# Altium project LED PD AB WH 3000149 (4F00227L_7P00500A).PrjPcb
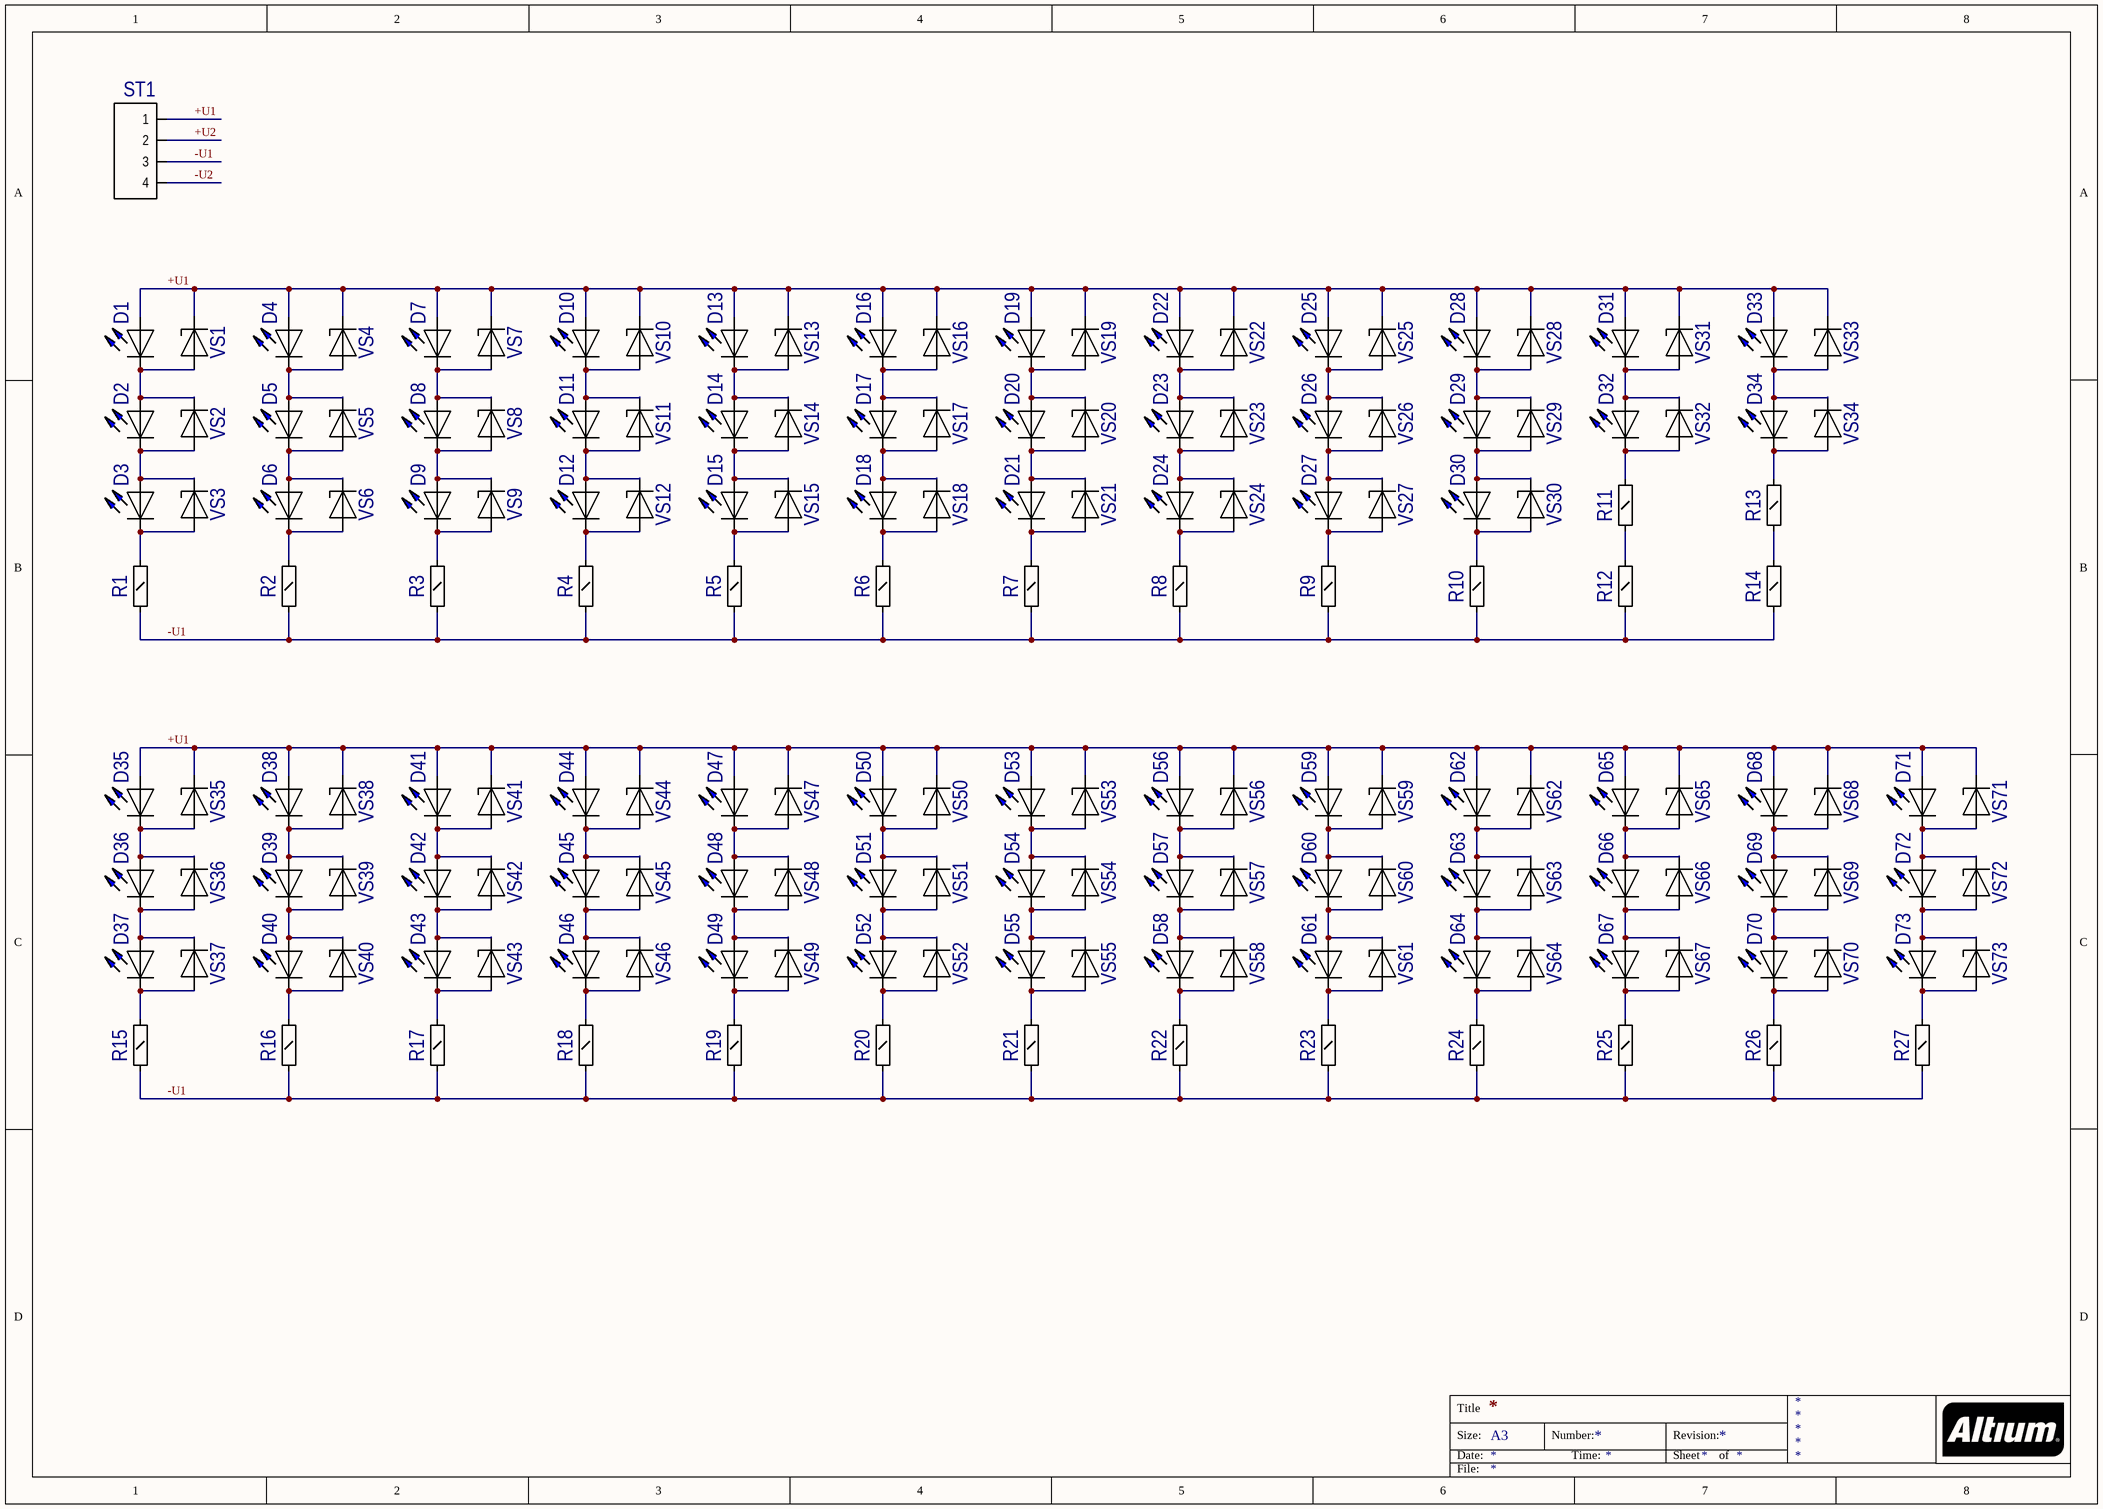
[diagram p0: LED PD AB WH 3000149 (4F00227L_7P00500A)_1.SchDoc]
2 sheets, 327 parts. Net scope: global (net labels, ports and power ports of the same name join across sheets).
Board file: LED PD AB WH 3000149 (4F00227L_7P00500A).PcbDoc
Sheets:
  LED PD AB WH 3000149 (4F00227L_7P00500A)_1.SchDoc
  LED PD AB WH 3000149 (4F00227L_7P00500A)_2.SchDoc

## Sheet LED PD AB WH 3000149 (4F00227L_7P00500A)_1.SchDoc
size A3

### Parts
D1  LT_T66G  [T66G]  (value not drawn)
D2  LT_T66G  [T66G]  (value not drawn)
D3  LT_T66G  [T66G]  (value not drawn)
D4  LT_T66G  [T66G]  (value not drawn)
D5  LT_T66G  [T66G]  (value not drawn)
D6  LT_T66G  [T66G]  (value not drawn)
D7  LT_T66G  [T66G]  (value not drawn)
D8  LT_T66G  [T66G]  (value not drawn)
D9  LT_T66G  [T66G]  (value not drawn)
D10  LT_T66G  [T66G]  (value not drawn)
D11  LT_T66G  [T66G]  (value not drawn)
D12  LT_T66G  [T66G]  (value not drawn)
D13  LT_T66G  [T66G]  (value not drawn)
D14  LT_T66G  [T66G]  (value not drawn)
D15  LT_T66G  [T66G]  (value not drawn)
D16  LT_T66G  [T66G]  (value not drawn)
D17  LT_T66G  [T66G]  (value not drawn)
D18  LT_T66G  [T66G]  (value not drawn)
D19  LT_T66G  [T66G]  (value not drawn)
D20  LT_T66G  [T66G]  (value not drawn)
D21  LT_T66G  [T66G]  (value not drawn)
D22  LT_T66G  [T66G]  (value not drawn)
D23  LT_T66G  [T66G]  (value not drawn)
D24  LT_T66G  [T66G]  (value not drawn)
D25  LT_T66G  [T66G]  (value not drawn)
D26  LT_T66G  [T66G]  (value not drawn)
D27  LT_T66G  [T66G]  (value not drawn)
D28  LT_T66G  [T66G]  (value not drawn)
D29  LT_T66G  [T66G]  (value not drawn)
D30  LT_T66G  [T66G]  (value not drawn)
D31  LT_T66G  [T66G]  (value not drawn)
D32  LT_T66G  [T66G]  (value not drawn)
D33  LT_T66G  [T66G]  (value not drawn)
D34  LT_T66G  [T66G]  (value not drawn)
D35  LT_T66G  [T66G]  (value not drawn)
D36  LT_T66G  [T66G]  (value not drawn)
D37  LT_T66G  [T66G]  (value not drawn)
D38  LT_T66G  [T66G]  (value not drawn)
D39  LT_T66G  [T66G]  (value not drawn)
D40  LT_T66G  [T66G]  (value not drawn)
D41  LT_T66G  [T66G]  (value not drawn)
D42  LT_T66G  [T66G]  (value not drawn)
D43  LT_T66G  [T66G]  (value not drawn)
D44  LT_T66G  [T66G]  (value not drawn)
D45  LT_T66G  [T66G]  (value not drawn)
D46  LT_T66G  [T66G]  (value not drawn)
D47  LT_T66G  [T66G]  (value not drawn)
D48  LT_T66G  [T66G]  (value not drawn)
D49  LT_T66G  [T66G]  (value not drawn)
D50  LT_T66G  [T66G]  (value not drawn)
D51  LT_T66G  [T66G]  (value not drawn)
D52  LT_T66G  [T66G]  (value not drawn)
D53  LT_T66G  [T66G]  (value not drawn)
D54  LT_T66G  [T66G]  (value not drawn)
D55  LT_T66G  [T66G]  (value not drawn)
D56  LT_T66G  [T66G]  (value not drawn)
D57  LT_T66G  [T66G]  (value not drawn)
D58  LT_T66G  [T66G]  (value not drawn)
D59  LT_T66G  [T66G]  (value not drawn)
D60  LT_T66G  [T66G]  (value not drawn)
D61  LT_T66G  [T66G]  (value not drawn)
D62  LT_T66G  [T66G]  (value not drawn)
D63  LT_T66G  [T66G]  (value not drawn)
D64  LT_T66G  [T66G]  (value not drawn)
D65  LT_T66G  [T66G]  (value not drawn)
D66  LT_T66G  [T66G]  (value not drawn)
D67  LT_T66G  [T66G]  (value not drawn)
D68  LT_T66G  [T66G]  (value not drawn)
D69  LT_T66G  [T66G]  (value not drawn)
D70  LT_T66G  [T66G]  (value not drawn)
D71  LT_T66G  [T66G]  (value not drawn)
D72  LT_T66G  [T66G]  (value not drawn)
D73  LT_T66G  [T66G]  (value not drawn)
R1  R1206S  [RC1206S]  (value not drawn)
R2  R1206S  [RC1206S]  (value not drawn)
R3  R1206S  [RC1206S]  (value not drawn)
R4  R1206S  [RC1206S]  (value not drawn)
R5  R1206S  [RC1206S]  (value not drawn)
R6  R1206S  [RC1206S]  (value not drawn)
R7  R1206S  [RC1206S]  (value not drawn)
R8  R1206S  [RC1206S]  (value not drawn)
R9  R1206S  [RC1206S]  (value not drawn)
R10  R1206S  [RC1206S]  (value not drawn)
R11  R1206S  [RC1206S]  (value not drawn)
R12  R1206S  [RC1206S]  (value not drawn)
R13  R1206S  [RC1206S]  (value not drawn)
R14  R1206S  [RC1206S]  (value not drawn)
R15  R1206S  [RC1206S]  (value not drawn)
R16  R1206S  [RC1206S]  (value not drawn)
R17  R1206S  [RC1206S]  (value not drawn)
R18  R1206S  [RC1206S]  (value not drawn)
R19  R1206S  [RC1206S]  (value not drawn)
R20  R1206S  [RC1206S]  (value not drawn)
R21  R1206S  [RC1206S]  (value not drawn)
R22  R1206S  [RC1206S]  (value not drawn)
R23  R1206S  [RC1206S]  (value not drawn)
R24  R1206S  [RC1206S]  (value not drawn)
R25  R1206S  [RC1206S]  (value not drawn)
R26  R1206S  [RC1206S]  (value not drawn)
R27  R1206S  [RC1206S]  (value not drawn)
ST1  BAND4  [BAND4]  (value not drawn)
VS1  BZX84  [SOT23]  (value not drawn)
VS2  BZX84  [SOT23]  (value not drawn)
VS3  BZX84  [SOT23]  (value not drawn)
VS4  BZX84  [SOT23]  (value not drawn)
VS5  BZX84  [SOT23]  (value not drawn)
VS6  BZX84  [SOT23]  (value not drawn)
VS7  BZX84  [SOT23]  (value not drawn)
VS8  BZX84  [SOT23]  (value not drawn)
VS9  BZX84  [SOT23]  (value not drawn)
VS10  BZX84  [SOT23]  (value not drawn)
VS11  BZX84  [SOT23]  (value not drawn)
VS12  BZX84  [SOT23]  (value not drawn)
VS13  BZX84  [SOT23]  (value not drawn)
VS14  BZX84  [SOT23]  (value not drawn)
VS15  BZX84  [SOT23]  (value not drawn)
VS16  BZX84  [SOT23]  (value not drawn)
VS17  BZX84  [SOT23]  (value not drawn)
VS18  BZX84  [SOT23]  (value not drawn)
VS19  BZX84  [SOT23]  (value not drawn)
VS20  BZX84  [SOT23]  (value not drawn)
VS21  BZX84  [SOT23]  (value not drawn)
VS22  BZX84  [SOT23]  (value not drawn)
VS23  BZX84  [SOT23]  (value not drawn)
VS24  BZX84  [SOT23]  (value not drawn)
VS25  BZX84  [SOT23]  (value not drawn)
VS26  BZX84  [SOT23]  (value not drawn)
VS27  BZX84  [SOT23]  (value not drawn)
VS28  BZX84  [SOT23]  (value not drawn)
VS29  BZX84  [SOT23]  (value not drawn)
VS30  BZX84  [SOT23]  (value not drawn)
VS31  BZX84  [SOT23]  (value not drawn)
VS32  BZX84  [SOT23]  (value not drawn)
VS33  BZX84  [SOT23]  (value not drawn)
VS34  BZX84  [SOT23]  (value not drawn)
VS35  BZX84  [SOT23]  (value not drawn)
VS36  BZX84  [SOT23]  (value not drawn)
VS37  BZX84  [SOT23]  (value not drawn)
VS38  BZX84  [SOT23]  (value not drawn)
VS39  BZX84  [SOT23]  (value not drawn)
VS40  BZX84  [SOT23]  (value not drawn)
VS41  BZX84  [SOT23]  (value not drawn)
VS42  BZX84  [SOT23]  (value not drawn)
VS43  BZX84  [SOT23]  (value not drawn)
VS44  BZX84  [SOT23]  (value not drawn)
VS45  BZX84  [SOT23]  (value not drawn)
VS46  BZX84  [SOT23]  (value not drawn)
VS47  BZX84  [SOT23]  (value not drawn)
VS48  BZX84  [SOT23]  (value not drawn)
VS49  BZX84  [SOT23]  (value not drawn)
VS50  BZX84  [SOT23]  (value not drawn)
VS51  BZX84  [SOT23]  (value not drawn)
VS52  BZX84  [SOT23]  (value not drawn)
VS53  BZX84  [SOT23]  (value not drawn)
VS54  BZX84  [SOT23]  (value not drawn)
VS55  BZX84  [SOT23]  (value not drawn)
VS56  BZX84  [SOT23]  (value not drawn)
VS57  BZX84  [SOT23]  (value not drawn)
VS58  BZX84  [SOT23]  (value not drawn)
VS59  BZX84  [SOT23]  (value not drawn)
VS60  BZX84  [SOT23]  (value not drawn)
VS61  BZX84  [SOT23]  (value not drawn)
VS62  BZX84  [SOT23]  (value not drawn)
VS63  BZX84  [SOT23]  (value not drawn)
VS64  BZX84  [SOT23]  (value not drawn)
VS65  BZX84  [SOT23]  (value not drawn)
VS66  BZX84  [SOT23]  (value not drawn)
VS67  BZX84  [SOT23]  (value not drawn)
VS68  BZX84  [SOT23]  (value not drawn)
VS69  BZX84  [SOT23]  (value not drawn)
VS70  BZX84  [SOT23]  (value not drawn)
VS71  BZX84  [SOT23]  (value not drawn)
VS72  BZX84  [SOT23]  (value not drawn)
VS73  BZX84  [SOT23]  (value not drawn)

### Nets
+U1: D1.2 D4.2 D7.2 D10.2 D13.2 D16.2 D19.2 D22.2 D25.2 D28.2 D31.2 D33.2 D35.2 D38.2 D41.2 D44.2 D47.2 D50.2 D53.2 D56.2 D59.2 D62.2 D65.2 D68.2 D71.2 ST1.1 VS1.3 VS4.3 VS7.3 VS10.3 VS13.3 VS16.3 VS19.3 VS22.3 VS25.3 VS28.3 VS31.3 VS33.3 VS35.3 VS38.3 VS41.3 VS44.3 VS47.3 VS50.3 VS53.3 VS56.3 VS59.3 VS62.3 VS65.3 VS68.3 VS71.3
+U2: ST1.2
-U1: R1.1 R2.1 R3.1 R4.1 R5.1 R6.1 R7.1 R8.1 R9.1 R10.1 R12.1 R14.1 R15.1 R16.1 R17.1 R18.1 R19.1 R20.1 R21.1 R22.1 R23.1 R24.1 R25.1 R26.1 R27.1 ST1.3
-U2: ST1.4
NetD1_1: D1.1 D2.2 VS1.1 VS2.3
NetD2_1: D2.1 D3.2 VS2.1 VS3.3
NetD3_1: D3.1 R1.2 VS3.1
NetD4_1: D4.1 D5.2 VS4.1 VS5.3
NetD5_1: D5.1 D6.2 VS5.1 VS6.3
NetD6_1: D6.1 R2.2 VS6.1
NetD7_1: D7.1 D8.2 VS7.1 VS8.3
NetD8_1: D8.1 D9.2 VS8.1 VS9.3
NetD9_1: D9.1 R3.2 VS9.1
NetD10_1: D10.1 D11.2 VS10.1 VS11.3
NetD11_1: D11.1 D12.2 VS11.1 VS12.3
NetD12_1: D12.1 R4.2 VS12.1
NetD13_1: D13.1 D14.2 VS13.1 VS14.3
NetD14_1: D14.1 D15.2 VS14.1 VS15.3
NetD15_1: D15.1 R5.2 VS15.1
NetD16_1: D16.1 D17.2 VS16.1 VS17.3
NetD17_1: D17.1 D18.2 VS17.1 VS18.3
NetD18_1: D18.1 R6.2 VS18.1
NetD19_1: D19.1 D20.2 VS19.1 VS20.3
NetD20_1: D20.1 D21.2 VS20.1 VS21.3
NetD21_1: D21.1 R7.2 VS21.1
NetD22_1: D22.1 D23.2 VS22.1 VS23.3
NetD23_1: D23.1 D24.2 VS23.1 VS24.3
NetD24_1: D24.1 R8.2 VS24.1
NetD25_1: D25.1 D26.2 VS25.1 VS26.3
NetD26_1: D26.1 D27.2 VS26.1 VS27.3
NetD27_1: D27.1 R9.2 VS27.1
NetD28_1: D28.1 D29.2 VS28.1 VS29.3
NetD29_1: D29.1 D30.2 VS29.1 VS30.3
NetD30_1: D30.1 R10.2 VS30.1
NetD31_1: D31.1 D32.2 VS31.1 VS32.3
NetD32_1: D32.1 R11.2 VS32.1
NetD33_1: D33.1 D34.2 VS33.1 VS34.3
NetD34_1: D34.1 R13.2 VS34.1
NetD35_1: D35.1 D36.2 VS35.1 VS36.3
NetD36_1: D36.1 D37.2 VS36.1 VS37.3
NetD37_1: D37.1 R15.2 VS37.1
NetD38_1: D38.1 D39.2 VS38.1 VS39.3
NetD39_1: D39.1 D40.2 VS39.1 VS40.3
NetD40_1: D40.1 R16.2 VS40.1
NetD41_1: D41.1 D42.2 VS41.1 VS42.3
NetD42_1: D42.1 D43.2 VS42.1 VS43.3
NetD43_1: D43.1 R17.2 VS43.1
NetD44_1: D44.1 D45.2 VS44.1 VS45.3
NetD45_1: D45.1 D46.2 VS45.1 VS46.3
NetD46_1: D46.1 R18.2 VS46.1
NetD47_1: D47.1 D48.2 VS47.1 VS48.3
NetD48_1: D48.1 D49.2 VS48.1 VS49.3
NetD49_1: D49.1 R19.2 VS49.1
NetD50_1: D50.1 D51.2 VS50.1 VS51.3
NetD51_1: D51.1 D52.2 VS51.1 VS52.3
NetD52_1: D52.1 R20.2 VS52.1
NetD53_1: D53.1 D54.2 VS53.1 VS54.3
NetD54_1: D54.1 D55.2 VS54.1 VS55.3
NetD55_1: D55.1 R21.2 VS55.1
NetD56_1: D56.1 D57.2 VS56.1 VS57.3
NetD57_1: D57.1 D58.2 VS57.1 VS58.3
NetD58_1: D58.1 R22.2 VS58.1
NetD59_1: D59.1 D60.2 VS59.1 VS60.3
NetD60_1: D60.1 D61.2 VS60.1 VS61.3
NetD61_1: D61.1 R23.2 VS61.1
NetD62_1: D62.1 D63.2 VS62.1 VS63.3
NetD63_1: D63.1 D64.2 VS63.1 VS64.3
NetD64_1: D64.1 R24.2 VS64.1
NetD65_1: D65.1 D66.2 VS65.1 VS66.3
NetD66_1: D66.1 D67.2 VS66.1 VS67.3
NetD67_1: D67.1 R25.2 VS67.1
NetD68_1: D68.1 D69.2 VS68.1 VS69.3
NetD69_1: D69.1 D70.2 VS69.1 VS70.3
NetD70_1: D70.1 R26.2 VS70.1
NetD71_1: D71.1 D72.2 VS71.1 VS72.3
NetD72_1: D72.1 D73.2 VS72.1 VS73.3
NetD73_1: D73.1 R27.2 VS73.1
NetR11_1: R11.1 R12.2
NetR13_1: R13.1 R14.2

Not connected (* = marked no-connect by the designer): ST1 5 6 7 8; VS1 2; VS2 2; VS3 2; VS4 2; VS5 2; VS6 2; VS7 2; VS8 2; VS9 2; VS10 2; VS11 2; VS12 2; VS13 2; VS14 2; VS15 2; VS16 2; VS17 2; VS18 2; VS19 2; VS20 2; VS21 2; VS22 2; VS23 2; VS24 2; VS25 2; VS26 2; VS27 2; VS28 2; VS29 2; VS30 2; VS31 2; VS32 2; VS33 2; VS34 2; VS35 2; VS36 2; VS37 2; VS38 2; VS39 2; VS40 2; VS41 2; VS42 2; VS43 2; VS44 2; VS45 2; VS46 2; VS47 2; VS48 2; VS49 2; VS50 2; VS51 2; VS52 2; VS53 2; VS54 2; VS55 2; VS56 2; VS57 2; VS58 2; VS59 2; VS60 2; VS61 2; VS62 2; VS63 2; VS64 2; VS65 2; VS66 2; VS67 2; VS68 2; VS69 2; VS70 2; VS71 2; VS72 2; VS73 2

### Notes on the sheet
- Title
- Size:
- Date:
- A3
- Number:
- Time:
- Revision:
- Sheet
- of
- File:

### Library data of the parts
D1-D73 = LT_T66G: {Description}
R1-R10 R12 R14-R27 = R1206S: Value: Pos.20
R11 R13 = R1206S: Value: Pos.22
VS1-VS73 = BZX84: OriginalName: DIODE; Value: *
ST1 = BAND4: Value: *

## Sheet LED PD AB WH 3000149 (4F00227L_7P00500A)_2.SchDoc
size 449 x 281 mm
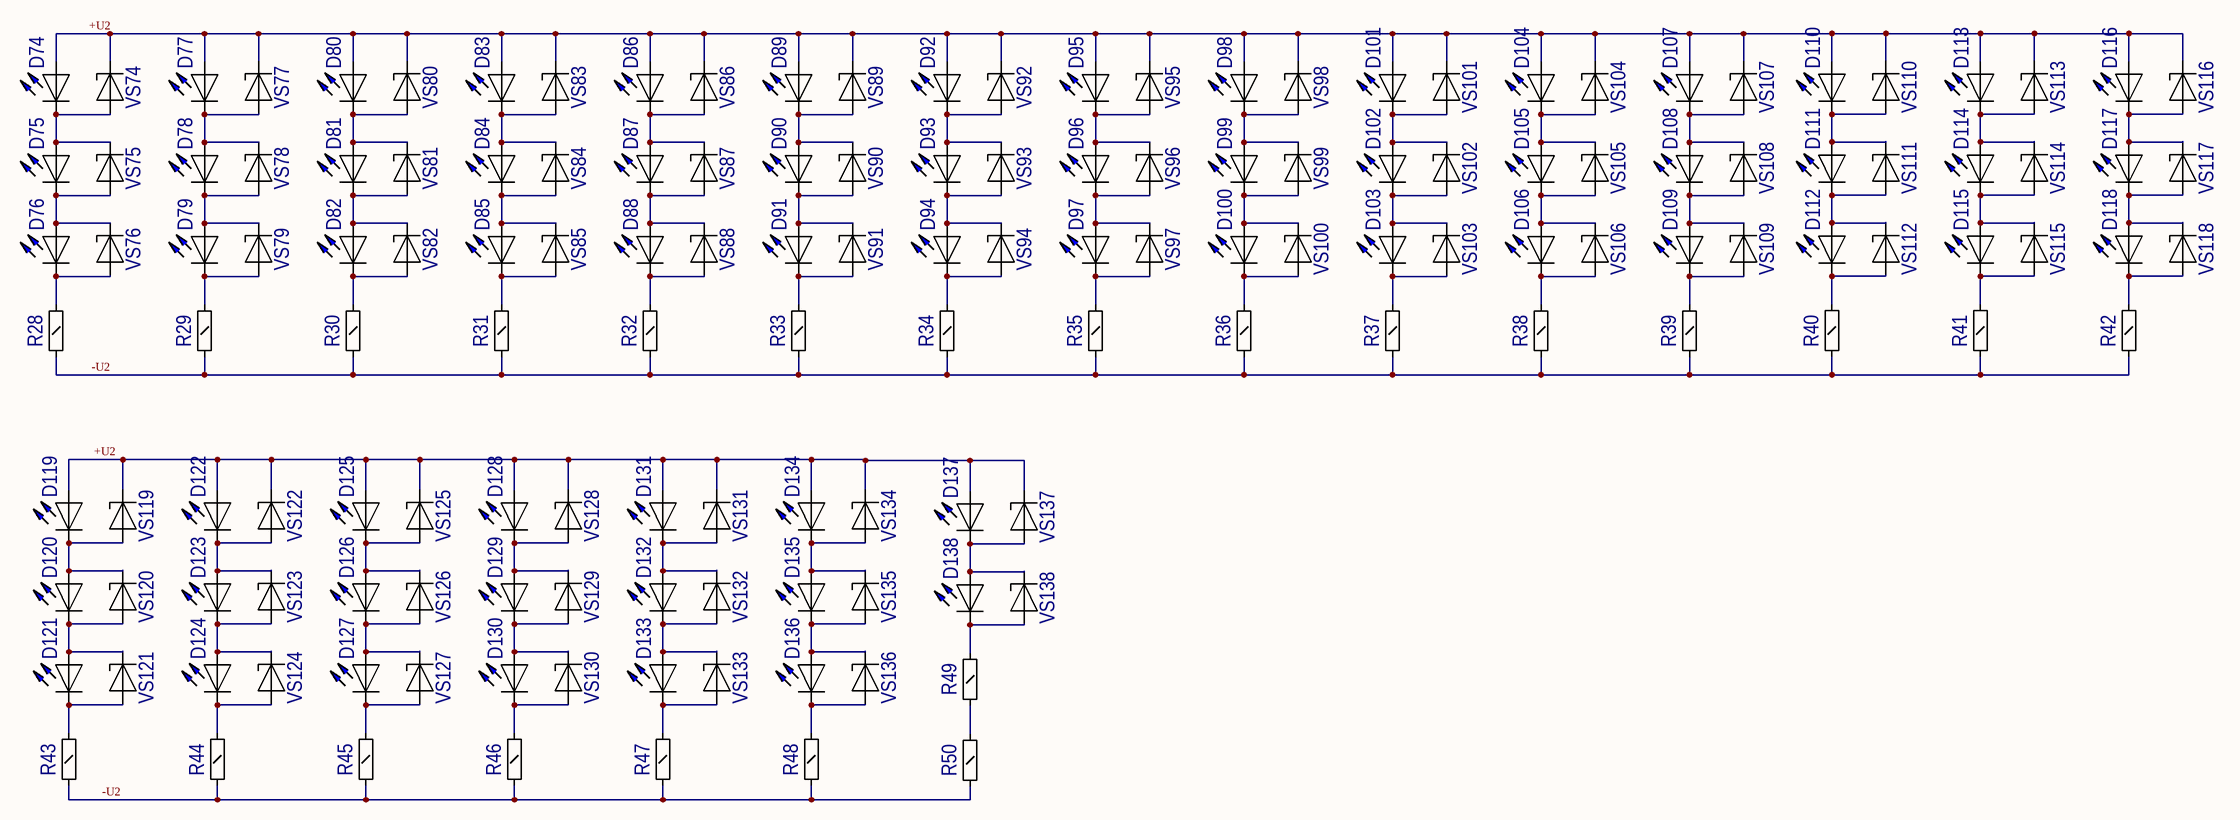
[diagram p1: LED PD AB WH 3000149 (4F00227L_7P00500A)_2.SchDoc]

### Parts
D74  LT_T66G  [T66G]  (value not drawn)
D75  LT_T66G  [T66G]  (value not drawn)
D76  LT_T66G  [T66G]  (value not drawn)
D77  LT_T66G  [T66G]  (value not drawn)
D78  LT_T66G  [T66G]  (value not drawn)
D79  LT_T66G  [T66G]  (value not drawn)
D80  LT_T66G  [T66G]  (value not drawn)
D81  LT_T66G  [T66G]  (value not drawn)
D82  LT_T66G  [T66G]  (value not drawn)
D83  LT_T66G  [T66G]  (value not drawn)
D84  LT_T66G  [T66G]  (value not drawn)
D85  LT_T66G  [T66G]  (value not drawn)
D86  LT_T66G  [T66G]  (value not drawn)
D87  LT_T66G  [T66G]  (value not drawn)
D88  LT_T66G  [T66G]  (value not drawn)
D89  LT_T66G  [T66G]  (value not drawn)
D90  LT_T66G  [T66G]  (value not drawn)
D91  LT_T66G  [T66G]  (value not drawn)
D92  LT_T66G  [T66G]  (value not drawn)
D93  LT_T66G  [T66G]  (value not drawn)
D94  LT_T66G  [T66G]  (value not drawn)
D95  LT_T66G  [T66G]  (value not drawn)
D96  LT_T66G  [T66G]  (value not drawn)
D97  LT_T66G  [T66G]  (value not drawn)
D98  LT_T66G  [T66G]  (value not drawn)
D99  LT_T66G  [T66G]  (value not drawn)
D100  LT_T66G  [T66G]  (value not drawn)
D101  LT_T66G  [T66G]  (value not drawn)
D102  LT_T66G  [T66G]  (value not drawn)
D103  LT_T66G  [T66G]  (value not drawn)
D104  LT_T66G  [T66G]  (value not drawn)
D105  LT_T66G  [T66G]  (value not drawn)
D106  LT_T66G  [T66G]  (value not drawn)
D107  LT_T66G  [T66G]  (value not drawn)
D108  LT_T66G  [T66G]  (value not drawn)
D109  LT_T66G  [T66G]  (value not drawn)
D110  LT_T66G  [T66G]  (value not drawn)
D111  LT_T66G  [T66G]  (value not drawn)
D112  LT_T66G  [T66G]  (value not drawn)
D113  LT_T66G  [T66G]  (value not drawn)
D114  LT_T66G  [T66G]  (value not drawn)
D115  LT_T66G  [T66G]  (value not drawn)
D116  LT_T66G  [T66G]  (value not drawn)
D117  LT_T66G  [T66G]  (value not drawn)
D118  LT_T66G  [T66G]  (value not drawn)
D119  LT_T66G  [T66G]  (value not drawn)
D120  LT_T66G  [T66G]  (value not drawn)
D121  LT_T66G  [T66G]  (value not drawn)
D122  LT_T66G  [T66G]  (value not drawn)
D123  LT_T66G  [T66G]  (value not drawn)
D124  LT_T66G  [T66G]  (value not drawn)
D125  LT_T66G  [T66G]  (value not drawn)
D126  LT_T66G  [T66G]  (value not drawn)
D127  LT_T66G  [T66G]  (value not drawn)
D128  LT_T66G  [T66G]  (value not drawn)
D129  LT_T66G  [T66G]  (value not drawn)
D130  LT_T66G  [T66G]  (value not drawn)
D131  LT_T66G  [T66G]  (value not drawn)
D132  LT_T66G  [T66G]  (value not drawn)
D133  LT_T66G  [T66G]  (value not drawn)
D134  LT_T66G  [T66G]  (value not drawn)
D135  LT_T66G  [T66G]  (value not drawn)
D136  LT_T66G  [T66G]  (value not drawn)
D137  LT_T66G  [T66G]  (value not drawn)
D138  LT_T66G  [T66G]  (value not drawn)
R28  R1206S  [RC1206S]  (value not drawn)
R29  R1206S  [RC1206S]  (value not drawn)
R30  R1206S  [RC1206S]  (value not drawn)
R31  R1206S  [RC1206S]  (value not drawn)
R32  R1206S  [RC1206S]  (value not drawn)
R33  R1206S  [RC1206S]  (value not drawn)
R34  R1206S  [RC1206S]  (value not drawn)
R35  R1206S  [RC1206S]  (value not drawn)
R36  R1206S  [RC1206S]  (value not drawn)
R37  R1206S  [RC1206S]  (value not drawn)
R38  R1206S  [RC1206S]  (value not drawn)
R39  R1206S  [RC1206S]  (value not drawn)
R40  R1206S  [RC1206S]  (value not drawn)
R41  R1206S  [RC1206S]  (value not drawn)
R42  R1206S  [RC1206S]  (value not drawn)
R43  R1206S  [RC1206S]  (value not drawn)
R44  R1206S  [RC1206S]  (value not drawn)
R45  R1206S  [RC1206S]  (value not drawn)
R46  R1206S  [RC1206S]  (value not drawn)
R47  R1206S  [RC1206S]  (value not drawn)
R48  R1206S  [RC1206S]  (value not drawn)
R49  R1206S  [RC1206S]  (value not drawn)
R50  R1206S  [RC1206S]  (value not drawn)
VS74  BZX84  [SOT23]  (value not drawn)
VS75  BZX84  [SOT23]  (value not drawn)
VS76  BZX84  [SOT23]  (value not drawn)
VS77  BZX84  [SOT23]  (value not drawn)
VS78  BZX84  [SOT23]  (value not drawn)
VS79  BZX84  [SOT23]  (value not drawn)
VS80  BZX84  [SOT23]  (value not drawn)
VS81  BZX84  [SOT23]  (value not drawn)
VS82  BZX84  [SOT23]  (value not drawn)
VS83  BZX84  [SOT23]  (value not drawn)
VS84  BZX84  [SOT23]  (value not drawn)
VS85  BZX84  [SOT23]  (value not drawn)
VS86  BZX84  [SOT23]  (value not drawn)
VS87  BZX84  [SOT23]  (value not drawn)
VS88  BZX84  [SOT23]  (value not drawn)
VS89  BZX84  [SOT23]  (value not drawn)
VS90  BZX84  [SOT23]  (value not drawn)
VS91  BZX84  [SOT23]  (value not drawn)
VS92  BZX84  [SOT23]  (value not drawn)
VS93  BZX84  [SOT23]  (value not drawn)
VS94  BZX84  [SOT23]  (value not drawn)
VS95  BZX84  [SOT23]  (value not drawn)
VS96  BZX84  [SOT23]  (value not drawn)
VS97  BZX84  [SOT23]  (value not drawn)
VS98  BZX84  [SOT23]  (value not drawn)
VS99  BZX84  [SOT23]  (value not drawn)
VS100  BZX84  [SOT23]  (value not drawn)
VS101  BZX84  [SOT23]  (value not drawn)
VS102  BZX84  [SOT23]  (value not drawn)
VS103  BZX84  [SOT23]  (value not drawn)
VS104  BZX84  [SOT23]  (value not drawn)
VS105  BZX84  [SOT23]  (value not drawn)
VS106  BZX84  [SOT23]  (value not drawn)
VS107  BZX84  [SOT23]  (value not drawn)
VS108  BZX84  [SOT23]  (value not drawn)
VS109  BZX84  [SOT23]  (value not drawn)
VS110  BZX84  [SOT23]  (value not drawn)
VS111  BZX84  [SOT23]  (value not drawn)
VS112  BZX84  [SOT23]  (value not drawn)
VS113  BZX84  [SOT23]  (value not drawn)
VS114  BZX84  [SOT23]  (value not drawn)
VS115  BZX84  [SOT23]  (value not drawn)
VS116  BZX84  [SOT23]  (value not drawn)
VS117  BZX84  [SOT23]  (value not drawn)
VS118  BZX84  [SOT23]  (value not drawn)
VS119  BZX84  [SOT23]  (value not drawn)
VS120  BZX84  [SOT23]  (value not drawn)
VS121  BZX84  [SOT23]  (value not drawn)
VS122  BZX84  [SOT23]  (value not drawn)
VS123  BZX84  [SOT23]  (value not drawn)
VS124  BZX84  [SOT23]  (value not drawn)
VS125  BZX84  [SOT23]  (value not drawn)
VS126  BZX84  [SOT23]  (value not drawn)
VS127  BZX84  [SOT23]  (value not drawn)
VS128  BZX84  [SOT23]  (value not drawn)
VS129  BZX84  [SOT23]  (value not drawn)
VS130  BZX84  [SOT23]  (value not drawn)
VS131  BZX84  [SOT23]  (value not drawn)
VS132  BZX84  [SOT23]  (value not drawn)
VS133  BZX84  [SOT23]  (value not drawn)
VS134  BZX84  [SOT23]  (value not drawn)
VS135  BZX84  [SOT23]  (value not drawn)
VS136  BZX84  [SOT23]  (value not drawn)
VS137  BZX84  [SOT23]  (value not drawn)
VS138  BZX84  [SOT23]  (value not drawn)

### Nets
+U2: D74.2 D77.2 D80.2 D83.2 D86.2 D89.2 D92.2 D95.2 D98.2 D101.2 D104.2 D107.2 D110.2 D113.2 D116.2 D119.2 D122.2 D125.2 D128.2 D131.2 D134.2 D137.2 VS74.3 VS77.3 VS80.3 VS83.3 VS86.3 VS89.3 VS92.3 VS95.3 VS98.3 VS101.3 VS104.3 VS107.3 VS110.3 VS113.3 VS116.3 VS119.3 VS122.3 VS125.3 VS128.3 VS131.3 VS134.3 VS137.3
-U2: R28.1 R29.1 R30.1 R31.1 R32.1 R33.1 R34.1 R35.1 R36.1 R37.1 R38.1 R39.1 R40.1 R41.1 R42.1 R43.1 R44.1 R45.1 R46.1 R47.1 R48.1 R50.1
NetD74_1: D74.1 D75.2 VS74.1 VS75.3
NetD75_1: D75.1 D76.2 VS75.1 VS76.3
NetD76_1: D76.1 R28.2 VS76.1
NetD77_1: D77.1 D78.2 VS77.1 VS78.3
NetD78_1: D78.1 D79.2 VS78.1 VS79.3
NetD79_1: D79.1 R29.2 VS79.1
NetD80_1: D80.1 D81.2 VS80.1 VS81.3
NetD81_1: D81.1 D82.2 VS81.1 VS82.3
NetD82_1: D82.1 R30.2 VS82.1
NetD83_1: D83.1 D84.2 VS83.1 VS84.3
NetD84_1: D84.1 D85.2 VS84.1 VS85.3
NetD85_1: D85.1 R31.2 VS85.1
NetD86_1: D86.1 D87.2 VS86.1 VS87.3
NetD87_1: D87.1 D88.2 VS87.1 VS88.3
NetD88_1: D88.1 R32.2 VS88.1
NetD89_1: D89.1 D90.2 VS89.1 VS90.3
NetD90_1: D90.1 D91.2 VS90.1 VS91.3
NetD91_1: D91.1 R33.2 VS91.1
NetD92_1: D92.1 D93.2 VS92.1 VS93.3
NetD93_1: D93.1 D94.2 VS93.1 VS94.3
NetD94_1: D94.1 R34.2 VS94.1
NetD95_1: D95.1 D96.2 VS95.1 VS96.3
NetD96_1: D96.1 D97.2 VS96.1 VS97.3
NetD97_1: D97.1 R35.2 VS97.1
NetD98_1: D98.1 D99.2 VS98.1 VS99.3
NetD99_1: D99.1 D100.2 VS99.1 VS100.3
NetD100_1: D100.1 R36.2 VS100.1
NetD101_1: D101.1 D102.2 VS101.1 VS102.3
NetD102_1: D102.1 D103.2 VS102.1 VS103.3
NetD103_1: D103.1 R37.2 VS103.1
NetD104_1: D104.1 D105.2 VS104.1 VS105.3
NetD105_1: D105.1 D106.2 VS105.1 VS106.3
NetD106_1: D106.1 R38.2 VS106.1
NetD107_1: D107.1 D108.2 VS107.1 VS108.3
NetD108_1: D108.1 D109.2 VS108.1 VS109.3
NetD109_1: D109.1 R39.2 VS109.1
NetD110_1: D110.1 D111.2 VS110.1 VS111.3
NetD111_1: D111.1 D112.2 VS111.1 VS112.3
NetD112_1: D112.1 R40.2 VS112.1
NetD113_1: D113.1 D114.2 VS113.1 VS114.3
NetD114_1: D114.1 D115.2 VS114.1 VS115.3
NetD115_1: D115.1 R41.2 VS115.1
NetD116_1: D116.1 D117.2 VS116.1 VS117.3
NetD117_1: D117.1 D118.2 VS117.1 VS118.3
NetD118_1: D118.1 R42.2 VS118.1
NetD119_1: D119.1 D120.2 VS119.1 VS120.3
NetD120_1: D120.1 D121.2 VS120.1 VS121.3
NetD121_1: D121.1 R43.2 VS121.1
NetD122_1: D122.1 D123.2 VS122.1 VS123.3
NetD123_1: D123.1 D124.2 VS123.1 VS124.3
NetD124_1: D124.1 R44.2 VS124.1
NetD125_1: D125.1 D126.2 VS125.1 VS126.3
NetD126_1: D126.1 D127.2 VS126.1 VS127.3
NetD127_1: D127.1 R45.2 VS127.1
NetD128_1: D128.1 D129.2 VS128.1 VS129.3
NetD129_1: D129.1 D130.2 VS129.1 VS130.3
NetD130_1: D130.1 R46.2 VS130.1
NetD131_1: D131.1 D132.2 VS131.1 VS132.3
NetD132_1: D132.1 D133.2 VS132.1 VS133.3
NetD133_1: D133.1 R47.2 VS133.1
NetD134_1: D134.1 D135.2 VS134.1 VS135.3
NetD135_1: D135.1 D136.2 VS135.1 VS136.3
NetD136_1: D136.1 R48.2 VS136.1
NetD137_1: D137.1 D138.2 VS137.1 VS138.3
NetD138_1: D138.1 R49.2 VS138.1
NetR49_1: R49.1 R50.2

Not connected (* = marked no-connect by the designer): VS74 2; VS75 2; VS76 2; VS77 2; VS78 2; VS79 2; VS80 2; VS81 2; VS82 2; VS83 2; VS84 2; VS85 2; VS86 2; VS87 2; VS88 2; VS89 2; VS90 2; VS91 2; VS92 2; VS93 2; VS94 2; VS95 2; VS96 2; VS97 2; VS98 2; VS99 2; VS100 2; VS101 2; VS102 2; VS103 2; VS104 2; VS105 2; VS106 2; VS107 2; VS108 2; VS109 2; VS110 2; VS111 2; VS112 2; VS113 2; VS114 2; VS115 2; VS116 2; VS117 2; VS118 2; VS119 2; VS120 2; VS121 2; VS122 2; VS123 2; VS124 2; VS125 2; VS126 2; VS127 2; VS128 2; VS129 2; VS130 2; VS131 2; VS132 2; VS133 2; VS134 2; VS135 2; VS136 2; VS137 2; VS138 2

### Library data of the parts
D74-D138 = LT_T66G: {Description}
R28-R48 R50 = R1206S: Value: Pos.20
R49 = R1206S: Value: Pos.22
VS74-VS138 = BZX84: OriginalName: DIODE; Value: *

## Nets that join several sheets
+U2: LED PD AB WH 3000149 (4F00227L_7P00500A)_1 (ST1.2), LED PD AB WH 3000149 (4F00227L_7P00500A)_2 (44 pins)
-U2: LED PD AB WH 3000149 (4F00227L_7P00500A)_1 (ST1.4), LED PD AB WH 3000149 (4F00227L_7P00500A)_2 (22 pins)